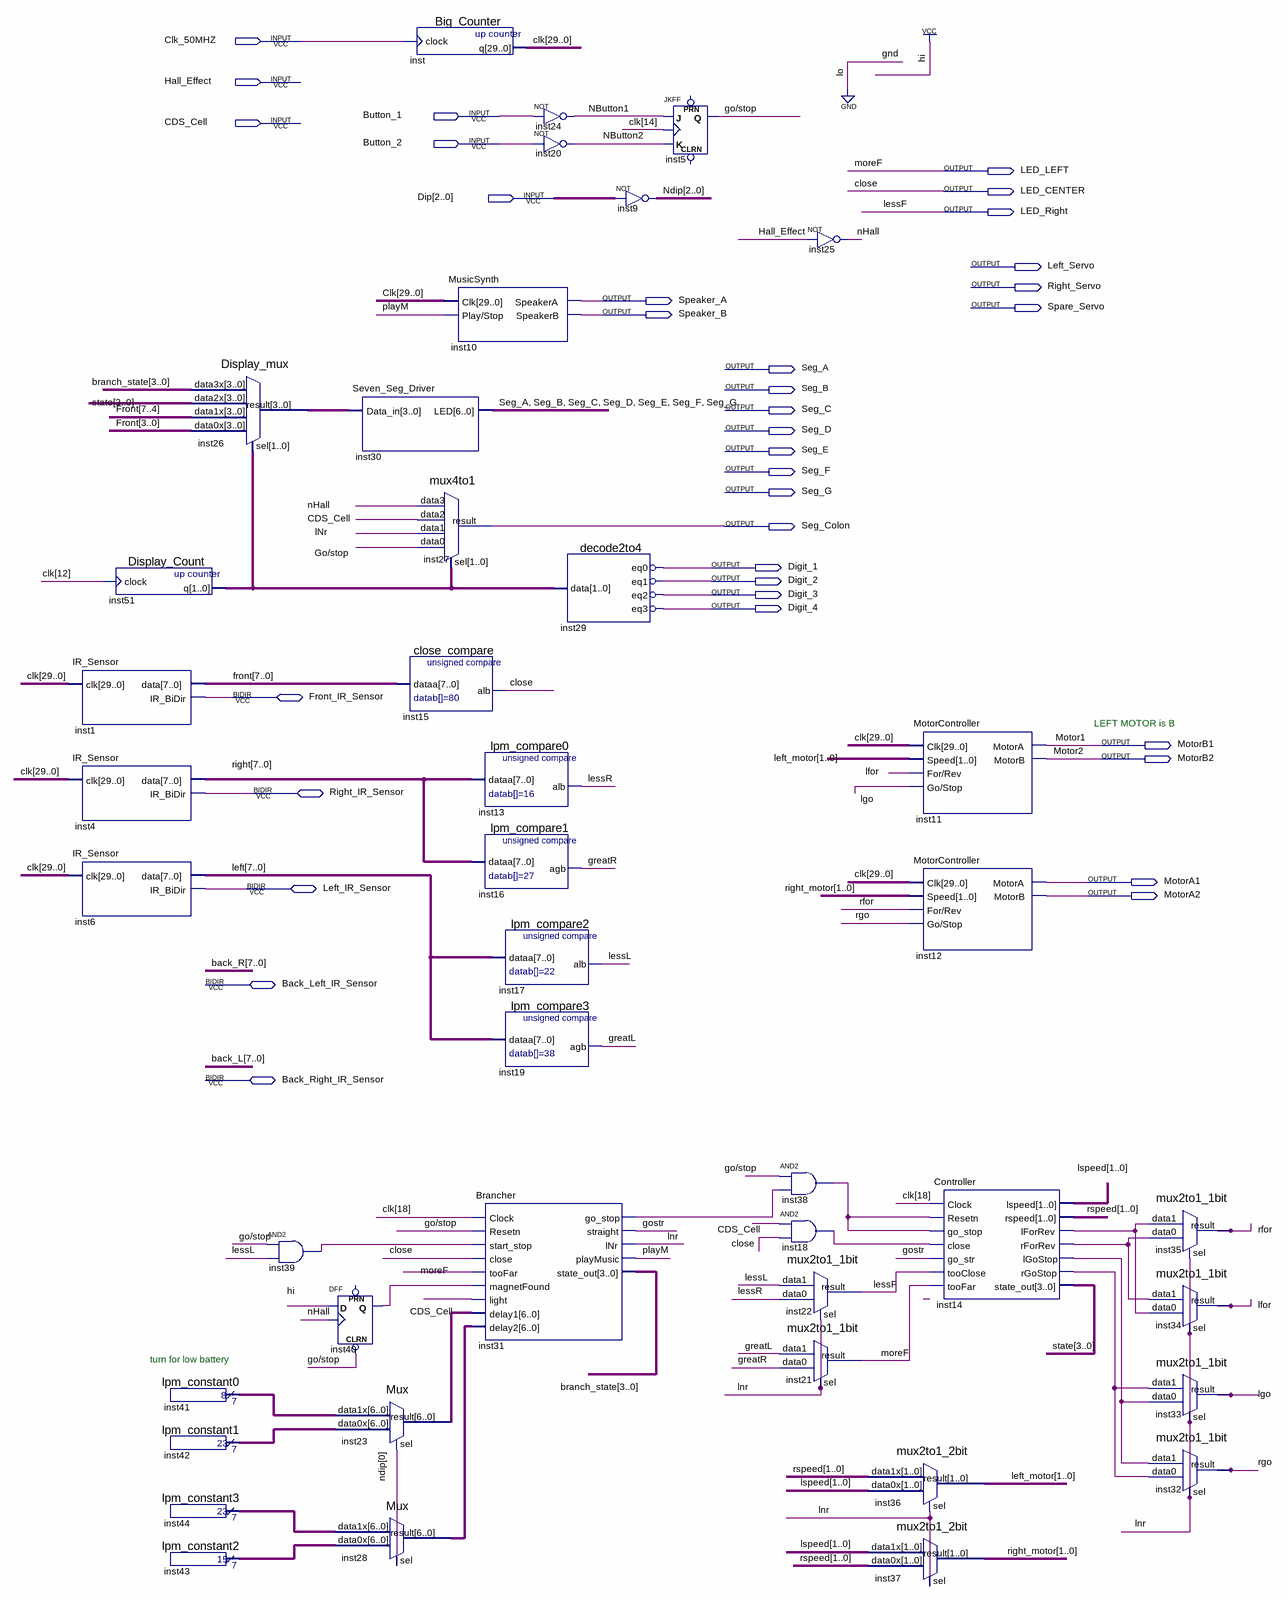
[diagram p0: schematic sheet]
// Quartus schematic Robot.bdf as structural Verilog: 42 symbols, 35 pins
module Robot (
  input  Clk_50MHZ,
  input  Hall_Effect,
  input  Button_1,
  input  CDS_Cell,
  input  Button_2,
  input  [2:0] Dip,
  inout  Front_IR_Sensor,
  inout  Right_IR_Sensor,
  inout  Left_IR_Sensor,
  inout  Back_Left_IR_Sensor,
  inout  Back_Right_IR_Sensor,
  output LED_LEFT,
  output LED_CENTER,
  output LED_Right,
  output Left_Servo,
  output Right_Servo,
  output Speaker_A,
  output Spare_Servo,
  output Speaker_B,
  output Seg_A,
  output Seg_B,
  output Seg_C,
  output Seg_D,
  output Seg_E,
  output Seg_F,
  output Seg_G,
  output Seg_Colon,
  output Digit_1,
  output Digit_2,
  output Digit_3,
  output Digit_4,
  output MotorB1,
  output MotorB2,
  output MotorA1,
  output MotorA2
);

  wire \go/stop , gostr, greatL, greatR, inst14_lforrev, inst14_lgostop, inst14_rforrev, inst14_rgostop,
       inst18_out, inst29_eq0, inst29_eq1, inst29_eq2, inst29_eq3, inst31_go_stop, inst38_out, inst39_out,
       inst40_q, lessL, lessR, lfor, lgo, lnr, NButton1, NButton2, nHall, playM, rfor, rgo;
  wire [1:0] inst51_q, left_motor, lspeed, right_motor, rspeed;
  wire [2:0] Ndip;
  wire [3:0] branch_state, inst26_result, state;
  wire [6:0] inst23_result, inst28_result, inst41_result, inst42_result, inst43_result, inst44_result;
  wire [7:0] front, left, right;
  wire [29:0] clk;

  IR_Sensor inst1 (.clk(clk), .data(front), .IR_BiDir(Front_IR_Sensor));
  IR_Sensor inst4 (.clk(clk), .data(right), .IR_BiDir(Right_IR_Sensor));
  IR_Sensor inst6 (.clk(clk), .data(left), .IR_BiDir(Left_IR_Sensor));
  Display_Count inst51 (.clock(clk[12]), .q(inst51_q));
  lpm_constant0 inst41 (.result(inst41_result));
  lpm_constant1 inst42 (.result(inst42_result));
  lpm_constant3 inst44 (.result(inst44_result));
  lpm_constant2 inst43 (.result(inst43_result));
  Display_mux inst26 (
    .data3x(branch_state), .data2x(state), .data1x(front[7:4]), .data0x(front[3:0]), .sel(inst51_q),
    .result(inst26_result));
  and inst39 (inst39_out, \go/stop , lessL);
  Seven_Seg_Driver inst30 (.Data_in(inst26_result), .LED({Seg_A, Seg_B, Seg_C, Seg_D, Seg_E, Seg_F, Seg_G}));
  DFF inst40 (.CLRN(\go/stop ), .CLK(nHall), .D(1'b1), .Q(inst40_q));  // open: PRN
  Mux inst23 (.data1x(inst41_result), .data0x(inst42_result), .sel(Ndip[0]), .result(inst23_result));
  Mux inst28 (.data1x(inst44_result), .data0x(inst43_result), .sel(Ndip[0]), .result(inst28_result));
  Big_Counter inst (.clock(Clk_50MHZ), .q(clk));
  close_compare inst15 (.dataa(front), .alb(LED_CENTER));
  MusicSynth inst10 (.Clk(clk), .\Play/Stop (playM), .SpeakerA(Speaker_A), .SpeakerB(Speaker_B));
  mux4to1 inst27 (.data3(nHall), .data2(CDS_Cell), .data1(lnr), .data0(\go/stop ), .sel(inst51_q), .result(Seg_Colon));
  lpm_compare0 inst13 (.dataa(right), .alb(lessR));
  lpm_compare1 inst16 (.dataa(right), .agb(greatR));
  lpm_compare2 inst17 (.dataa(left), .alb(lessL));
  lpm_compare3 inst19 (.dataa(left), .agb(greatL));
  Brancher inst31 (
    .Clock(clk[18]), .Resetn(\go/stop ), .start_stop(inst39_out), .close(LED_CENTER), .tooFar(LED_LEFT),
    .magnetFound(inst40_q), .light(CDS_Cell), .delay1(inst23_result), .delay2(inst28_result),
    .go_stop(inst31_go_stop), .straight(gostr), .lNr(lnr), .playMusic(playM), .state_out(branch_state));
  not inst24 (NButton1, Button_1);
  not inst20 (NButton2, Button_2);
  decode2to4 inst29 (.data(inst51_q), .eq0(inst29_eq0), .eq1(inst29_eq1), .eq2(inst29_eq2), .eq3(inst29_eq3));
  not inst29_eq0_inverted (Digit_1, inst29_eq0);
  not inst29_eq1_inverted (Digit_2, inst29_eq1);
  not inst29_eq2_inverted (Digit_3, inst29_eq2);
  not inst29_eq3_inverted (Digit_4, inst29_eq3);
  assign Ndip = ~Dip;  // NOT inst9, 3 bits wide
  JKFF inst5 (.K(NButton2), .J(NButton1), .CLK(clk[14]), .Q(\go/stop ));  // open: PRN, CLRN
  and inst38 (inst38_out, \go/stop , inst31_go_stop);
  and inst18 (inst18_out, CDS_Cell, LED_CENTER);
  mux2to1_1bit inst22 (.data1(lessL), .data0(lessR), .sel(lnr), .result(LED_Right));
  mux2to1_1bit inst21 (.data1(greatL), .data0(greatR), .sel(lnr), .result(LED_LEFT));
  not inst25 (nHall, Hall_Effect);
  mux2to1_2bit inst36 (.data1x(rspeed), .data0x(lspeed), .sel(lnr), .result(left_motor));
  mux2to1_2bit inst37 (.data1x(lspeed), .data0x(rspeed), .sel(lnr), .result(right_motor));
  MotorController inst11 (
    .Clk(clk), .Speed(left_motor), .\For/Rev (lfor), .\Go/Stop (lgo), .MotorA(MotorB1), .MotorB(MotorB2));
  MotorController inst12 (
    .Clk(clk), .Speed(right_motor), .\For/Rev (rfor), .\Go/Stop (rgo), .MotorA(MotorA1), .MotorB(MotorA2));
  Controller inst14 (
    .Clock(clk[18]), .Resetn(inst38_out), .go_stop(inst38_out), .close(inst18_out), .go_str(gostr),
    .tooClose(LED_Right), .tooFar(LED_LEFT), .lspeed(lspeed), .rspeed(rspeed), .lForRev(inst14_lforrev),
    .rForRev(inst14_rforrev), .lGoStop(inst14_lgostop), .rGoStop(inst14_rgostop), .state_out(state));
  mux2to1_1bit inst35 (.data1(inst14_lforrev), .data0(inst14_rforrev), .sel(lnr), .result(rfor));
  mux2to1_1bit inst34 (.data1(inst14_rforrev), .data0(inst14_lforrev), .sel(lnr), .result(lfor));
  mux2to1_1bit inst33 (.data1(inst14_rgostop), .data0(inst14_lgostop), .sel(lnr), .result(lgo));
  mux2to1_1bit inst32 (.data1(inst14_lgostop), .data0(inst14_rgostop), .sel(lnr), .result(rgo));

  // Other names for the same wires on the sheet: close = LED_CENTER; lessF = LED_Right; moreF = LED_LEFT;
  //   Motor1 = MotorB1; Motor2 = MotorB2

  // Notes on the sheet:
  //   LEFT MOTOR is B
  //   turn for low battery
endmodule
